# Altium schematic sheet USB3.0HUB_1.SCHDOC
size A4
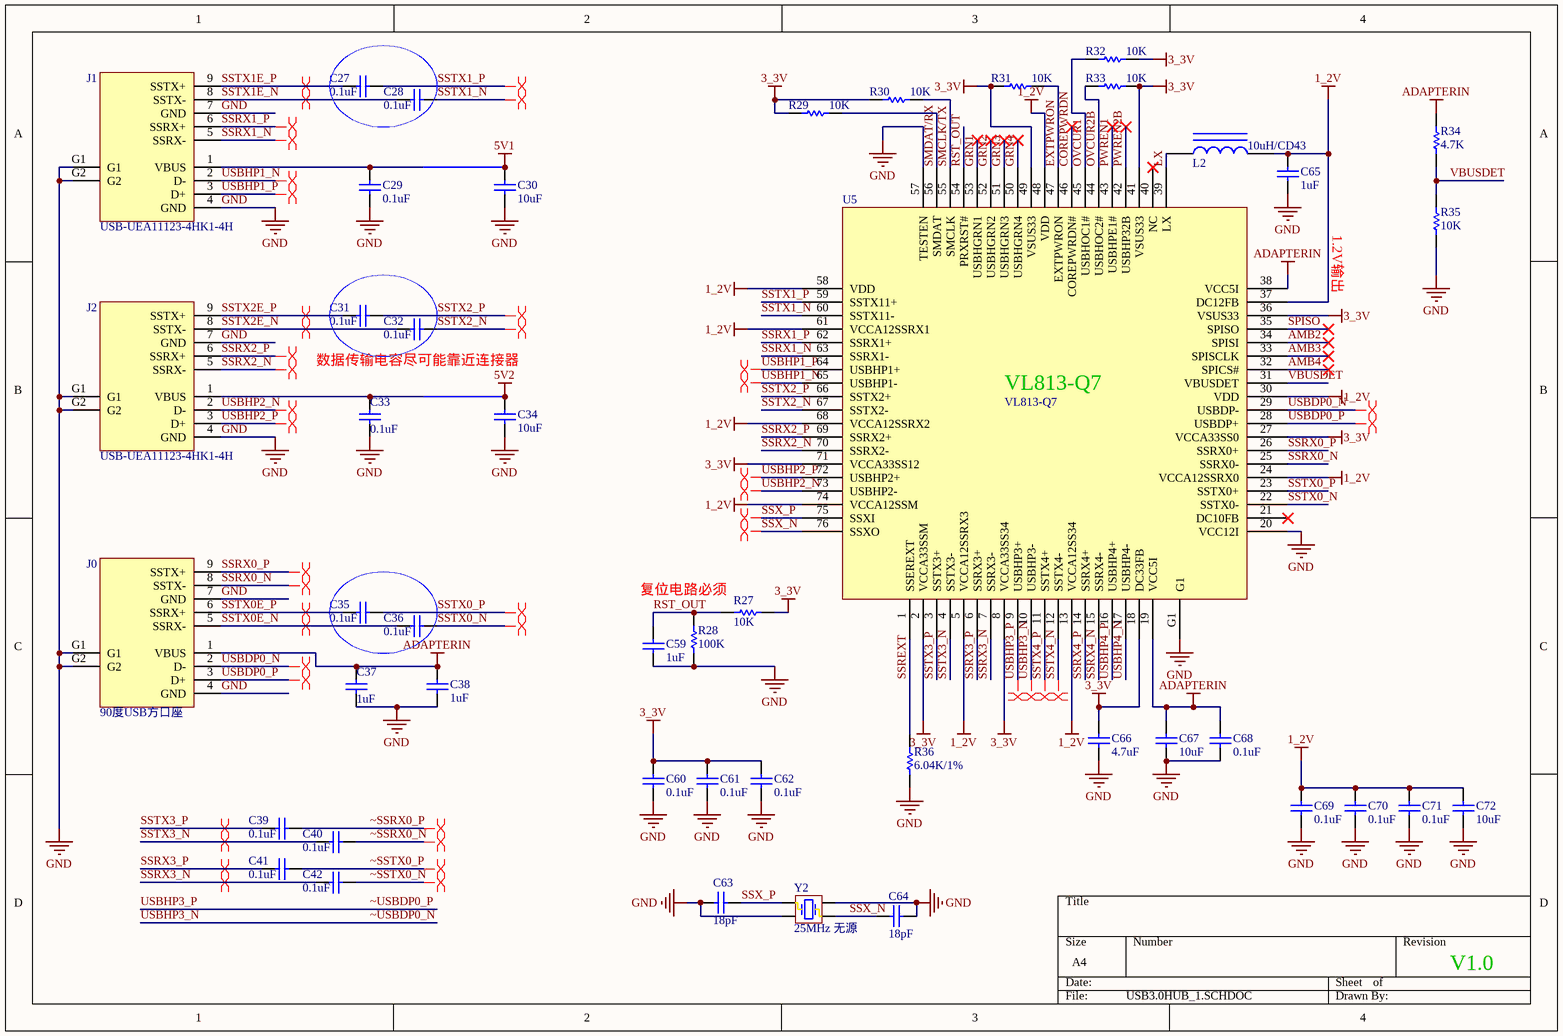
[diagram p0: USB3.0HUB_1.SCHDOC]

## Parts
C27  0.1uF  [0603C]
C28  0.1uF  [0603C]
C29  0.1uF  [0603C]
C30  10uF  [0805C]
C31  0.1uF  [0603C]
C32  0.1uF  [0603C]
C33  0.1uF  [0603C]
C34  10uF  [0805C]
C35  0.1uF  [0603C]
C36  0.1uF  [0603C]
C37  1uF  [0603C]
C38  1uF  [0603C]
C39  0.1uF  [0603C]
C40  0.1uF  [0603C]
C41  0.1uF  [0603C]
C42  0.1uF  [0603C]
C59  1uF  [0603C]
C60  0.1uF  [0603C]
C61  0.1uF  [0603C]
C62  0.1uF  [0603C]
C63  18pF  [0603C]
C64  18pF  [0603C]
C65  1uF  [0603C]
C66  4.7uF  [3216]
C67  10uF  [3216]
C68  0.1uF  [0603C]
C69  0.1uF  [0603C]
C70  0.1uF  [0603C]
C71  0.1uF  [0603C]
C72  10uF  [3216]
J0  90度USB方口座  [USB-B-R]
J1  USB-UEA11123-4HK1-4H  [USB3.0-A]
J2  USB-UEA11123-4HK1-4H  [USB3.0-A]
L2  10uH/CD43  [CD4532]
R27  10K  [0603R]
R28  100K  [0603R]
R29  10K  [0603R]
R30  10K  [0603R]
R31  10K  [0603R]
R32  10K  [0603R]
R33  10K  [0603R]
R34  4.7K  [0603R]
R35  10K  [0603R]
R36  6.04K/1%  [0603R]
U5  VL813-Q7  [QFN76-15P7-TH]
Y2  25MHz 无源  [X3225]

## Nets
1_2V: C65.2 C69.2 C70.2 C71.2 C72.1 L2.2 U5.5(VCCA12SSRX3) U5.13(VCCA12SS34) U5.24(VCCA12SSRX0) U5.30(VDD) U5.37(DC12FB) U5.48(VDD) U5.58(VDD) U5.61(VCCA12SSRX1) U5.68(VCCA12SSRX2) U5.74(VCCA12SSM)
3_3V: C60.2 C61.2 C62.2 C66.1 R27.1 R29.1 R30.1 R31.1 R32.1 R33.1 U5.2(VCCA33SSM) U5.8(VCCA33SS34) U5.18(DC33FB) U5.27(VCCA33SS0) U5.36(VSUS33) U5.41(VSUS33) U5.49(VSUS33) U5.71(VCCA33SS12)
5V1: C29.2 C30.1 J1.1(VBUS)
5V2: C33.2 C34.1 J2.1(VBUS)
ADAPTERIN: C37.2 C38.2 C67.1 C68.2 J0.1(VBUS) R34.1 U5.19(VCC5I) U5.38(VCC5I)
GND: C29.1 C30.2 C33.1 C34.2 C37.1 C38.1 C59.1 C60.1 C61.1 C62.1 C63.1 C64.1 C65.1 C66.2 C67.2 C68.1 C69.1 C70.1 C71.1 C72.2 J0.4(GND) J0.7(GND) J0.G1 J0.G2 J1.4(GND) J1.7(GND) J1.G1 J1.G2 J2.4(GND) J2.7(GND) J2.G1 J2.G2 R28.2 R35.2 R36.2 U5.20(VCC12I) U5.57(TESTEN) U5.G1 Y2.2(NA) Y2.4(NA)
AMB2: U5.34(SPISI)
AMB3: U5.33(SPISCLK)
AMB4: U5.32(SPICS#)
COREPWRDN: U5.46(COREPWRDN#)
EXTPWRON: R31.2 U5.47(EXTPWRON)
GRN1: U5.53(USBHGRN1)
GRN2: U5.52(USBHGRN2)
GRN3: U5.51(USBHGRN3)
GRN4: U5.50(USBHGRN4)
LX: L2.1 U5.39(LX)
OVCUR1: R32.2 U5.45(USBHOC1#)
OVCUR2B: R33.2 U5.44(USBHOC2#)
PWREN1: U5.43(USBHPE1#)
PWREN2B: U5.42(USBHP32B)
RST_OUT: C59.2 R27.2 R28.1 U5.54(PRXRST#)
SMCLK/TX: R30.2 U5.55(SMCLK)
SMDAT/RX: R29.2 U5.56(SMDAT)
SPISO: U5.35(SPISO)
SSREXT: R36.1 U5.1(SSEREXT)
SSRX0_N: J0.8(SSTX-) U5.25(SSRX0-)
SSRX0_P: J0.9(SSTX+) U5.26(SSRX0+)
SSRX1_N: J1.5(SSRX-) U5.63(SSRX1-)
SSRX1_P: J1.6(SSRX+) U5.62(SSRX1+)
SSRX2_N: J2.5(SSRX-) U5.70(SSRX2-)
SSRX2_P: J2.6(SSRX+) U5.69(SSRX2+)
SSRX3_N: C42.2 U5.7(SSRX3-)
SSRX3_P: C41.2 U5.6(SSRX3+)
SSRX4_N: U5.15(SSRX4-)
SSRX4_P: U5.14(SSRX4+)
SSTX0_N: C36.1 U5.22(SSTX0-)
SSTX0_P: C35.1 U5.23(SSTX0+)
SSTX0E_N: C36.2 J0.5(SSRX-)
SSTX0E_P: C35.2 J0.6(SSRX+)
SSTX1_N: C28.1 U5.60(SSTX11-)
SSTX1_P: C27.1 U5.59(SSTX11+)
SSTX1E_N: C28.2 J1.8(SSTX-)
SSTX1E_P: C27.2 J1.9(SSTX+)
SSTX2_N: C32.1 U5.67(SSTX2-)
SSTX2_P: C31.1 U5.66(SSTX2+)
SSTX2E_N: C32.2 J2.8(SSTX-)
SSTX2E_P: C31.2 J2.9(SSTX+)
SSTX3_N: C40.2 U5.4(SSTX3-)
SSTX3_P: C39.2 U5.3(SSTX3+)
SSTX4_N: U5.12(SSTX4-)
SSTX4_P: U5.11(SSTX4+)
SSX_N: C64.2 U5.76(SSXO) Y2.3(OSC2)
SSX_P: C63.2 U5.75(SSXI) Y2.1(OSC1)
USBDP0_N: J0.2(D-) U5.29(USBDP-)
USBDP0_P: J0.3(D+) U5.28(USBDP+)
USBHP1_N: J1.2(D-) U5.65(USBHP1-)
USBHP1_P: J1.3(D+) U5.64(USBHP1+)
USBHP2_N: J2.2(D-) U5.73(USBHP2-)
USBHP2_P: J2.3(D+) U5.72(USBHP2+)
USBHP3_N: U5.10(USBHP3-)  [also labelled ~USBDP0_N]
USBHP3_P: U5.9(USBHP3+)  [also labelled ~USBDP0_P]
USBHP4_N: U5.17(USBHP4-)
USBHP4_P: U5.16(USBHP4+)
VBUSDET: R34.2 R35.1 U5.31(VBUSDET)
~SSRX0_N: C40.1
~SSRX0_P: C39.1
~SSTX0_N: C42.1
~SSTX0_P: C41.1

Not connected (* = marked no-connect by the designer): U5 21(DC10FB)* 40(NC)*

## Layout directives
differential pair: SSRX0_N, SSRX0_P, SSRX1_N, SSRX1_P, SSRX2_N, SSRX2_P, SSRX3_N, SSRX3_P, SSTX0_N, SSTX0_P, SSTX0E_N, SSTX0E_P, SSTX1_N, SSTX1_P, SSTX1E_N, SSTX1E_P, SSTX2_N, SSTX2_P, SSTX2E_N, SSTX2E_P, SSTX3_N, SSTX3_P, SSTX4_N, SSTX4_P, SSX_N, SSX_P, USBDP0_N, USBDP0_P, USBHP1_N, USBHP1_P, USBHP2_N, USBHP2_P, USBHP3_N, USBHP3_P, ~SSRX0_N, ~SSRX0_P, ~SSTX0_N, ~SSTX0_P

## Notes on the sheet
- 1.2V输出
- 数据传输电容尽可能靠近连接器
- 复位电路必须
- Labels drawn without touching a wire or pin: V1.0, VL813-Q7

## Library data of the parts
C27-C42 C59-C72 = Cap: Capacitor; Published: 8-Jun-2000; LatestRevisionDate: 17-Jul-2002; LatestRevisionNote: Re-released for DXP Platform.; PackageReference: RAD-0.3; Publisher: Altium Limited
  C27-C29 C31-C33 C35 C36 C39-C42 C60-C62 C68-C71: Value: 0.1uF
  C30 C34 C67 C72: Value: 10uF
  C37 C38 C59 C65: Value: 1uF
  C63 C64: Value: 18pF
  C66: Value: 4.7uF
J0-J2 = USB_DSP
L2 = INDUCTOR IRON
R27-R36 = Res: 贴片电阻; Published: 8-Jun-2000; LatestRevisionDate: 17-Jul-2002; LatestRevisionNote: Re-released for DXP Platform.; PackageReference: AXIAL-0.3; Publisher: Altium Limited
  R27 R29-R33 R35: Value: 10K
  R28: Value: 100K
  R34: Value: 4.7K
  R36: Value: 6.04K/1%
U5 = VL812-Q7
Y2 = XTAL_1: Crystal Oscillator; Published: 8-Jun-2000; LatestRevisionDate: 17-Jul-2002; LatestRevisionNote: Re-released for DXP Platform.; PackageReference: R38; Publisher: Altium Limited; Value: 25MHz 无源